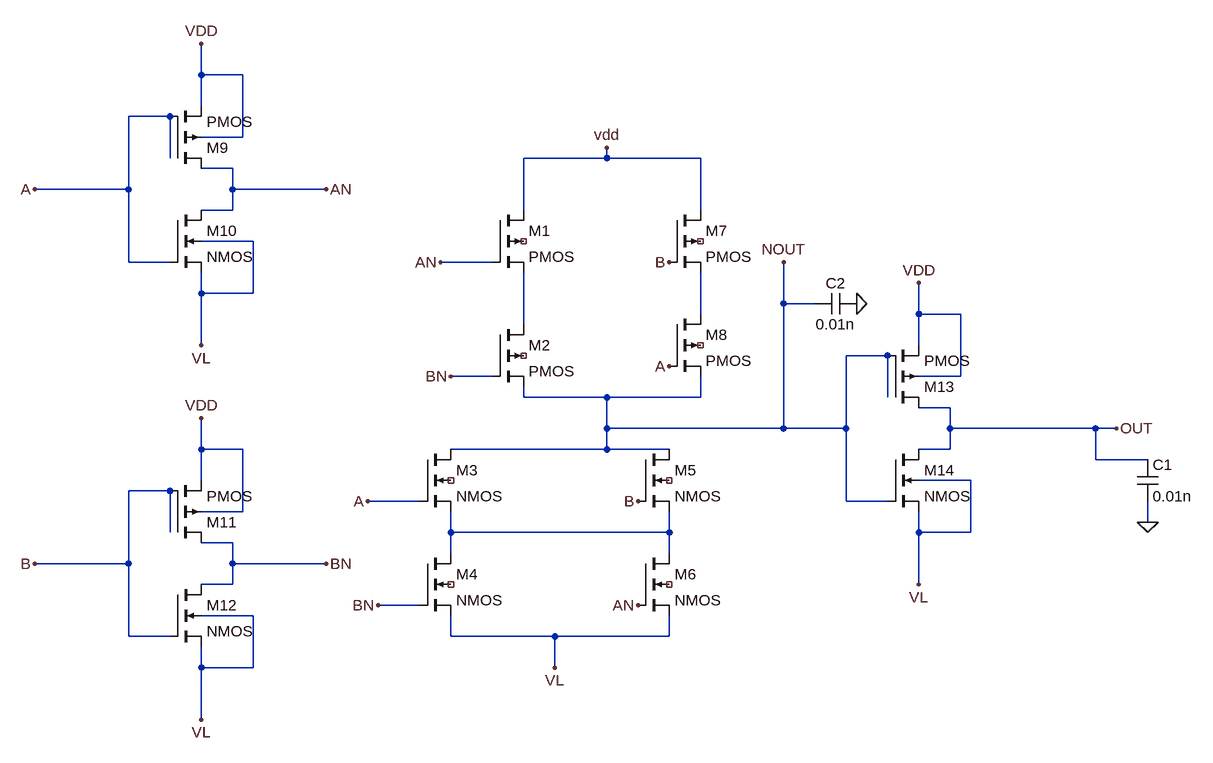
[diagram p0: schematic XOR_GATE.asc]
XOR_GATE.asc, the LTspice schematic file:
Version 4
SHEET 1 1020 680
WIRE -512 -432 -512 -480
WIRE -448 -432 -512 -432
WIRE -512 -384 -512 -432
WIRE -560 -368 -624 -368
WIRE -448 -336 -448 -432
WIRE -448 -336 -512 -336
WIRE -560 -304 -560 -368
WIRE 112 -304 112 -320
WIRE 112 -304 -16 -304
WIRE 256 -304 112 -304
WIRE -464 -288 -512 -288
WIRE -624 -256 -624 -368
WIRE -624 -256 -768 -256
WIRE -464 -256 -464 -288
WIRE -320 -256 -464 -256
WIRE -464 -224 -464 -256
WIRE -464 -224 -512 -224
WIRE -16 -224 -16 -304
WIRE 256 -224 256 -304
WIRE -432 -176 -512 -176
WIRE -624 -144 -624 -256
WIRE -560 -144 -624 -144
WIRE -64 -144 -144 -144
WIRE -512 -96 -512 -128
WIRE -432 -96 -432 -176
WIRE -432 -96 -512 -96
WIRE 384 -80 384 -144
WIRE 432 -80 384 -80
WIRE 256 -64 256 -128
WIRE 592 -64 592 -112
WIRE 656 -64 592 -64
WIRE -16 -48 -16 -128
WIRE -512 -16 -512 -96
WIRE 592 -16 592 -64
WIRE 544 0 480 0
WIRE -64 32 -128 32
WIRE 656 32 656 -64
WIRE 656 32 592 32
WIRE -16 64 -16 48
WIRE 112 64 -16 64
WIRE 256 64 256 32
WIRE 256 64 112 64
WIRE 544 64 544 0
WIRE 640 80 592 80
WIRE 112 112 112 64
WIRE 384 112 384 -80
WIRE 384 112 112 112
WIRE 480 112 480 0
WIRE 480 112 384 112
WIRE 640 112 640 80
WIRE 864 112 640 112
WIRE 896 112 864 112
WIRE -512 144 -512 96
WIRE -448 144 -512 144
WIRE 112 144 112 112
WIRE 112 144 -128 144
WIRE 208 144 112 144
WIRE 640 144 640 112
WIRE 640 144 592 144
WIRE 864 160 864 112
WIRE 944 160 864 160
WIRE -512 192 -512 144
WIRE 672 192 592 192
WIRE -560 208 -624 208
WIRE -176 224 -256 224
WIRE 480 224 480 112
WIRE 544 224 480 224
WIRE -448 240 -448 144
WIRE -448 240 -512 240
WIRE 944 256 944 224
WIRE -560 272 -560 208
WIRE -128 272 -128 240
WIRE 208 272 208 240
WIRE 208 272 -128 272
WIRE 592 272 592 240
WIRE 672 272 672 192
WIRE 672 272 592 272
WIRE -464 288 -512 288
WIRE -128 304 -128 272
WIRE 208 304 208 272
WIRE -624 320 -624 208
WIRE -624 320 -768 320
WIRE -464 320 -464 288
WIRE -320 320 -464 320
WIRE -464 352 -464 320
WIRE -464 352 -512 352
WIRE 592 352 592 272
WIRE -176 384 -240 384
WIRE -432 400 -512 400
WIRE -624 432 -624 320
WIRE -560 432 -624 432
WIRE -128 432 -128 400
WIRE 32 432 -128 432
WIRE 208 432 208 400
WIRE 208 432 32 432
WIRE -512 480 -512 448
WIRE -432 480 -432 400
WIRE -432 480 -512 480
WIRE 32 480 32 432
WIRE -512 560 -512 480
FLAG -144 -144 AN
FLAG 160 224 B
FLAG -256 224 A
FLAG -128 32 BN
FLAG 112 -320 vdd
FLAG 208 -144 B
FLAG 208 16 A
FLAG -240 384 BN
FLAG 896 112 OUT
FLAG 160 384 AN
FLAG 944 256 0
FLAG -320 -256 AN
FLAG -512 -16 VL
FLAG -512 -480 VDD
FLAG -768 -256 A
FLAG -320 320 BN
FLAG -512 560 VL
FLAG -512 96 VDD
FLAG -768 320 B
FLAG 32 480 VL
FLAG 592 352 VL
FLAG 592 -112 VDD
FLAG 384 -144 NOUT
FLAG 496 -80 0
SYMBOL pmos4 -64 -224 R0
SYMATTR InstName M1
SYMBOL pmos4 -64 -48 R0
SYMATTR InstName M2
SYMBOL nmos4 -176 144 R0
SYMATTR InstName M3
SYMBOL nmos4 -176 304 R0
SYMATTR InstName M4
SYMBOL nmos4 160 144 R0
SYMATTR InstName M5
SYMBOL nmos4 160 304 R0
SYMATTR InstName M6
SYMBOL pmos4 208 -224 R0
SYMATTR InstName M7
SYMBOL pmos4 208 -64 R0
SYMATTR InstName M8
SYMBOL cap 928 160 R0
SYMATTR InstName C1
SYMATTR Value 0.01n
SYMBOL pmos4 -560 -288 M180
SYMATTR InstName M9
SYMBOL nmos4 -560 -224 R0
SYMATTR InstName M10
SYMBOL pmos4 -560 288 M180
SYMATTR InstName M11
SYMBOL nmos4 -560 352 R0
SYMATTR InstName M12
SYMBOL pmos4 544 80 M180
SYMATTR InstName M13
SYMBOL nmos4 544 144 R0
SYMATTR InstName M14
SYMBOL cap 496 -96 R90
WINDOW 0 0 32 VBottom 2
WINDOW 3 32 32 VTop 2
SYMATTR InstName C2
SYMATTR Value 0.01n

The netlist it stands for:
* XOR_GATE.asc
M1 vdd AN N002 NC_01 PMOS
M2 N002 BN NOUT NC_02 PMOS
M3 NOUT A N003 NC_03 NMOS
M4 N003 BN VL NC_04 NMOS
M5 NOUT B N003 NC_05 NMOS
M6 N003 AN VL NC_06 NMOS
M7 vdd B N001 NC_07 PMOS
M8 N001 A NOUT NC_08 PMOS
C1 OUT 0 0.01n
M9 AN A vdd vdd PMOS
M10 AN A VL VL NMOS
M11 BN B vdd vdd PMOS
M12 BN B VL VL NMOS
M13 OUT NOUT vdd vdd PMOS
M14 OUT NOUT VL VL NMOS
C2 0 NOUT 0.01n
.model NMOS NMOS
.model PMOS PMOS
.lib standard.mos
.backanno
.end